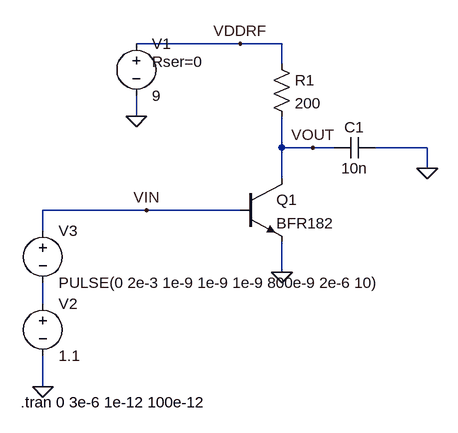
[diagram p0: schematic board_ota.asc]
board_ota.asc, the LTspice schematic file:
Version 4
SHEET 1 880 680
WIRE 192 -96 32 -96
WIRE 256 -96 192 -96
WIRE 256 -64 256 -96
WIRE 32 16 32 -16
WIRE 256 64 256 16
WIRE 304 64 256 64
WIRE 336 64 304 64
WIRE 480 64 400 64
WIRE 480 96 480 64
WIRE 256 112 256 64
WIRE 48 160 -112 160
WIRE 192 160 48 160
WIRE -112 192 -112 160
WIRE 256 256 256 208
WIRE -112 304 -112 272
WIRE -112 432 -112 384
FLAG 256 256 0
FLAG 480 96 0
FLAG 32 16 0
FLAG -112 432 0
FLAG 48 160 VIN
FLAG 304 64 VOUT
FLAG 192 -96 VDDRF
SYMBOL npn 192 112 R0
SYMATTR InstName Q1
SYMATTR Value BFR182
SYMBOL res 240 -80 R0
SYMATTR InstName R1
SYMATTR Value 200
SYMBOL cap 400 48 R90
WINDOW 0 0 32 VBottom 2
WINDOW 3 32 32 VTop 2
SYMATTR InstName C1
SYMATTR Value 10n
SYMBOL voltage 32 -112 R0
WINDOW 123 0 0 Left 0
WINDOW 39 24 44 Left 2
SYMATTR InstName V1
SYMATTR Value 9
SYMATTR SpiceLine Rser=0
SYMBOL voltage -112 288 R0
WINDOW 123 0 0 Left 0
WINDOW 39 0 0 Left 0
SYMATTR InstName V2
SYMATTR Value 1.1
SYMBOL voltage -112 176 R0
WINDOW 123 0 0 Left 0
WINDOW 39 0 0 Left 0
SYMATTR InstName V3
SYMATTR Value PULSE(0 2e-3 1e-9 1e-9 1e-9 800e-9 2e-6 10)
TEXT -146 456 Left 2 !.tran 0 3e-6 1e-12 100e-12

The netlist it stands for:
* board_ota.asc
Q1 VOUT VIN 0 0 BFR182
R1 VDDRF VOUT 200
C1 0 VOUT 10n
V1 VDDRF 0 9 Rser=0
V2 N001 0 1.1
V3 VIN N001 PULSE(0 2e-3 1e-9 1e-9 1e-9 800e-9 2e-6 10)
.model NPN NPN
.model PNP PNP
.lib standard.bjt
.tran 0 3e-6 1e-12 100e-12
.backanno
.end